# EasyEDA schematic Schematic_6502.json
TITLE: 6502 Computer schematics; REV: 1.0; Date: 2023-03-18; Sheet: 1/1; Drawn By: Alexandre Dumont; Company: -
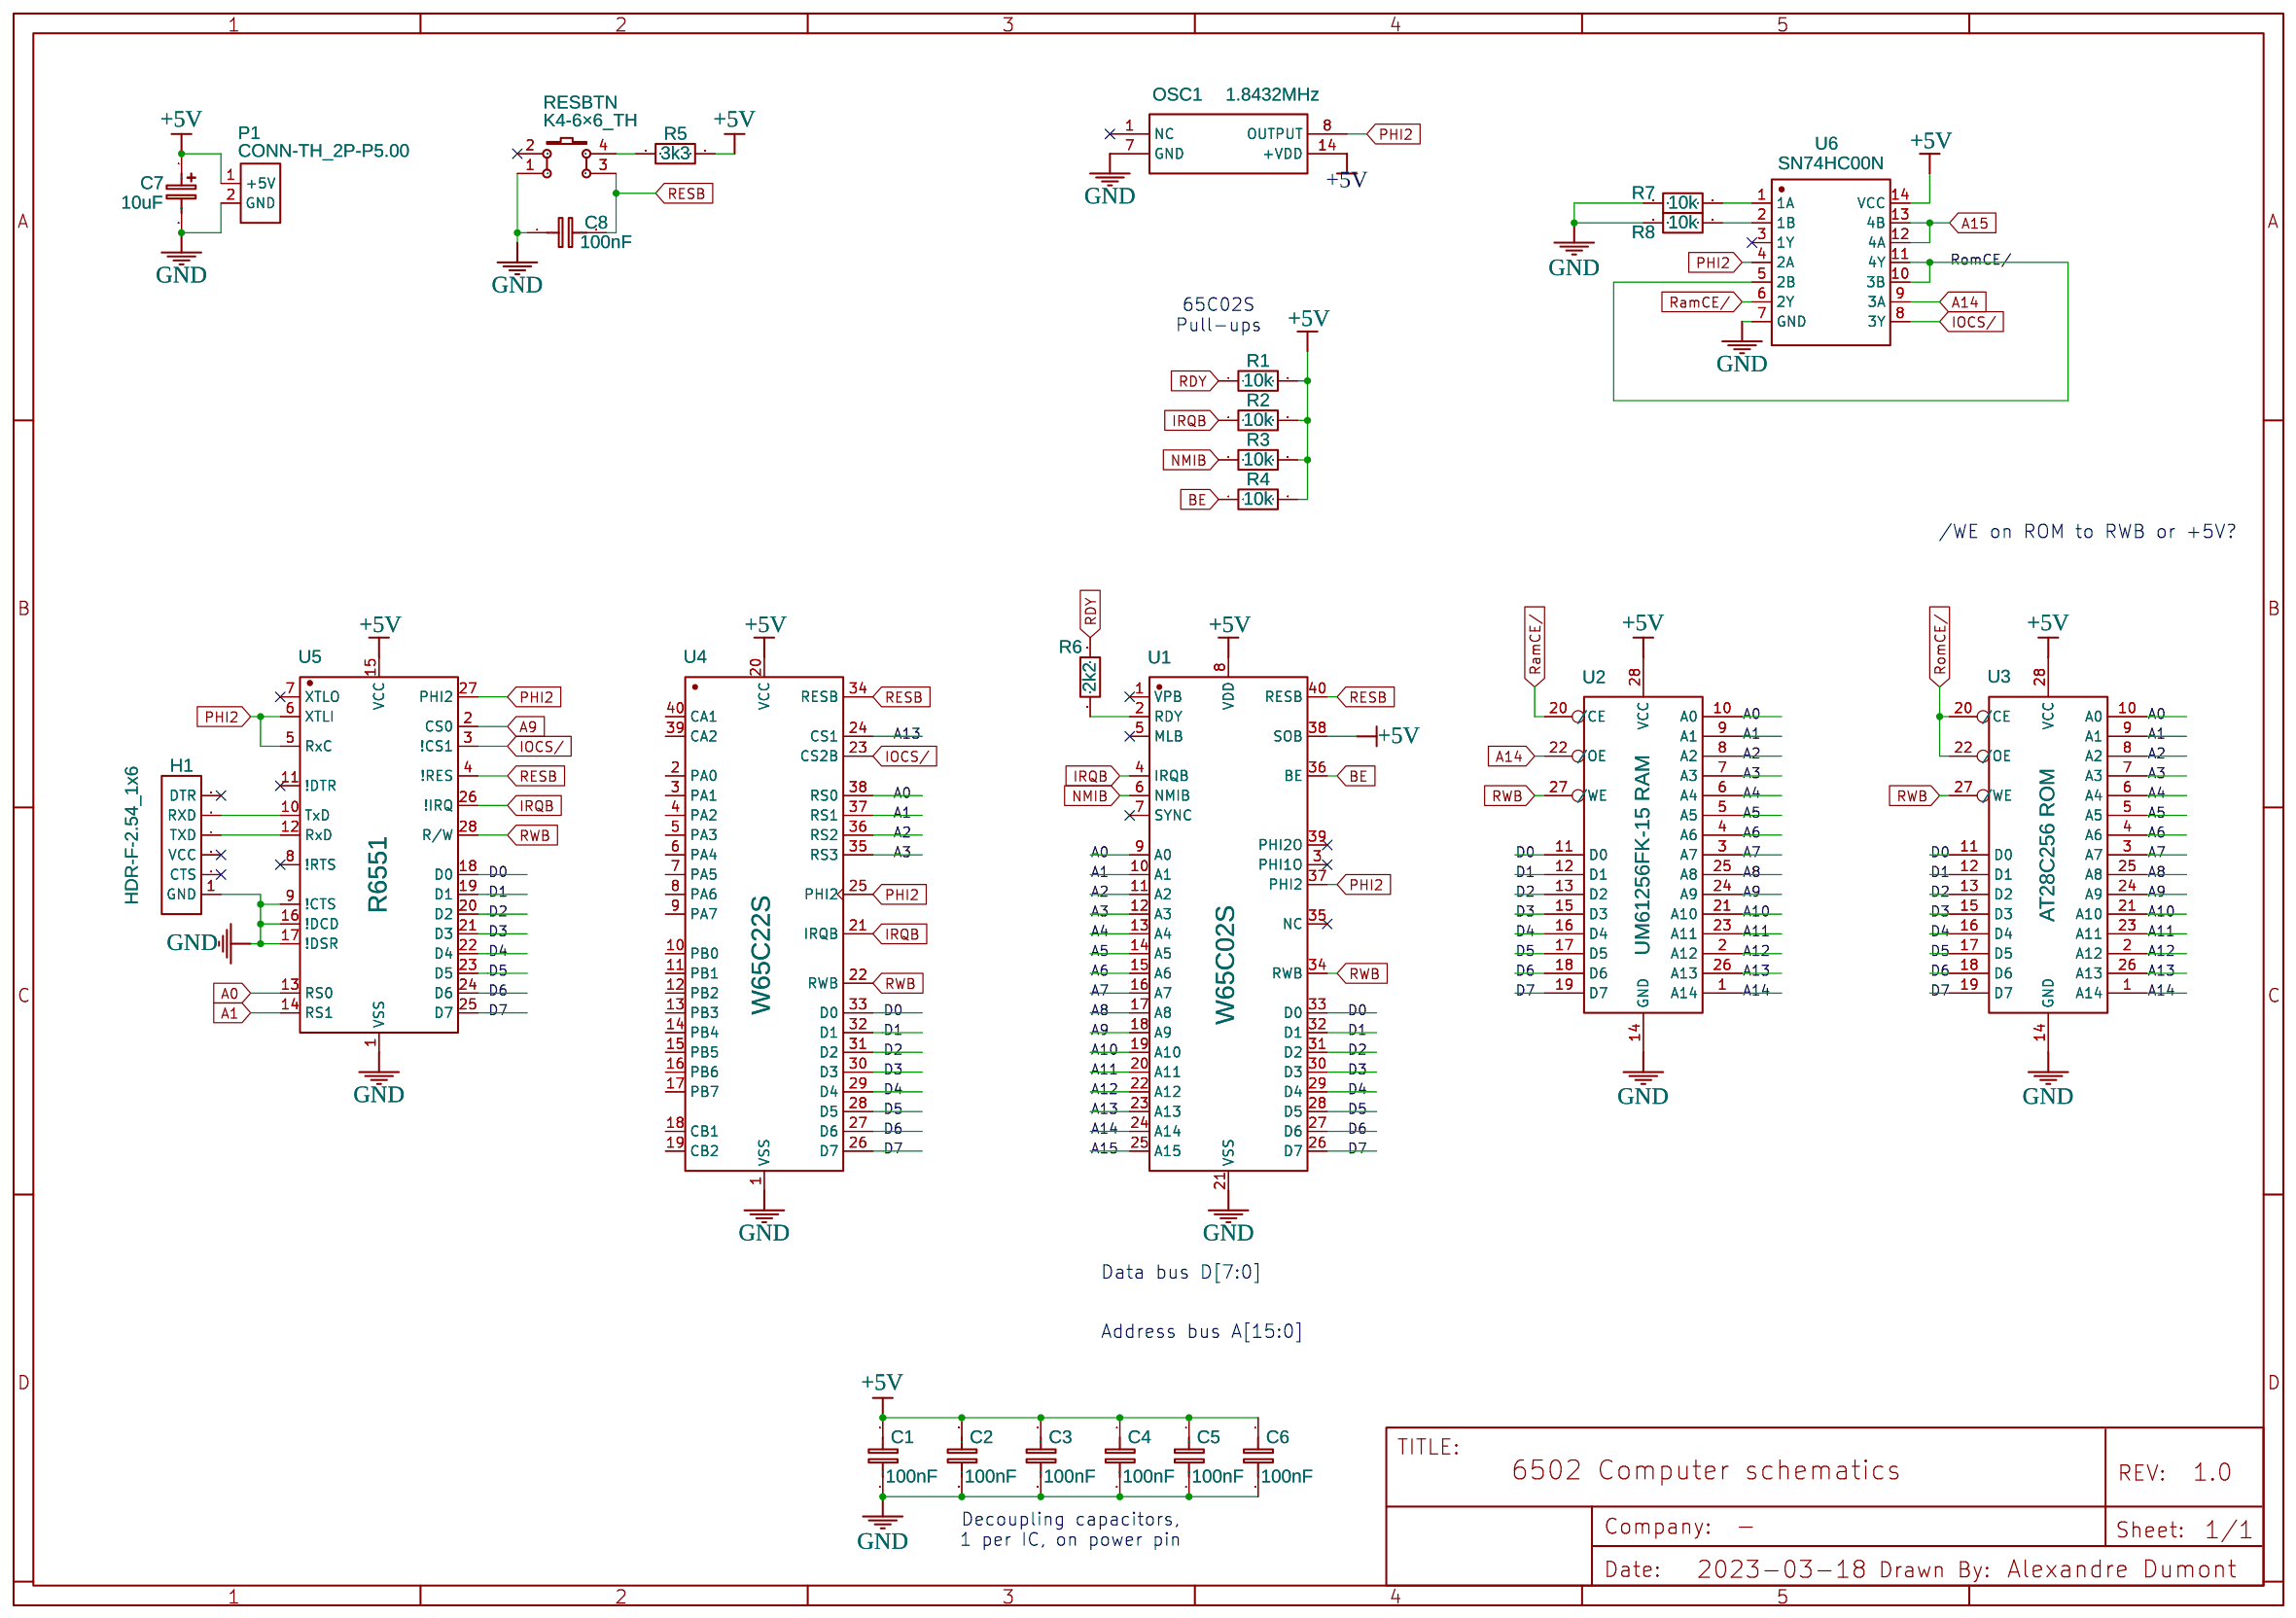
[diagram p0: schematic sheet]

## Parts
C1  100nF  [RAD-0.2]
C2  100nF  [RAD-0.2]
C3  100nF  [RAD-0.2]
C4  100nF  [RAD-0.2]
C5  100nF  [RAD-0.2]
C6  100nF  [RAD-0.2]
C7  10uF  [CAP-D5.0×F2.0]
C8  100nF  [RAD-0.2]
H1  HDR-F-2.54_1x6  [HDR-F-2.54_1X6]
OSC1  1.8432MHz  [QX14T50B1.843200B50TT]
P1  CONN-TH_2P-P5.00  [CONN-TH_2P-P5.00]
R1  10k  [R_AXIAL-0.5]
R2  10k  [R_AXIAL-0.5]
R3  10k  [R_AXIAL-0.5]
R4  10k  [R_AXIAL-0.5]
R5  3k3  [R_AXIAL-0.5]
R6  2k2  [R_AXIAL-0.5]
R7  10k  [R_AXIAL-0.5]
R8  10k  [R_AXIAL-0.5]
RESBTN  K4-6×6_TH  [KEY-TH_4P-L6.0-W6.0-P4.50-LS6.5]
U1  W65C02S  [DIP-40_L52.3-W13.9-P2.54-LS15.2-BL]
U2  UM61256FK-15 RAM  [DIP-28-300MIL-DZ]
U3  AT28C256 ROM  [DIP-28_L36.8-W15.5-P2.54-LS16.5-BL_AT28C256]
U4  W65C22S  [DIP-40_L52.3-W13.9-P2.54-LS15.2-BL]
U5  R6551  [DIP28-600]
U6  SN74HC00N  [DIP-14_L20.0-W7.6-P2.54-LS7.6-BL]

## Library data of the parts
C1-C6 C8 = C_RAD-0.2_EU: Contributor: LCEDA_Lib
C7 = CE_TH_D5.0×F2.0_EU: Contributor: LCEDA_Lib
H1 = HDR-F-2.54_1x6: Supplier Part: C40877; Supplier: LCSC; Contributor: LCEDA_Lib
OSC1 = QX14T50B1.843200B50TT: Contributor: milesaero
P1 = CONN-TH_2P-P5.00: Supplier: LCSC; Contributor: LCEDA_Lib
R1-R8 = R_AXIAL-0.5_EU: Contributor: LCEDA_Lib
RESBTN = K4-6×6_TH: Supplier: LCSC; Supplier Part: C136684; Manufacturer: 韩国韩荣; Manufacturer Part: K2-1102DP-E4SW-04; Contributor: LCEDA_Lib
U1 = W65C02S6TPG-14 BUS GROUPED: Manufacturer: Western Design Center (WDC); Manufacturer Part: W65C02S6TPG-14; Supplier: Mouser; Supplier Part: 955-W65C02S6TPG-14; link: https://www.mouser.es/datasheet/2/436/w65c02s-2572.pdf; Contributor: adumont
U2 U3 = AT28C256: Contributor: Alexandre Dumont
U4 = W65C22S6TPG-14 BUS GROUPED: Manufacturer: Western Design Center (WDC); Manufacturer Part: W65C22S6TPG-14; Supplier: Mouser; Supplier Part: 955-W65C22S6TPG-14; link: https://www.mouser.es/datasheet/2/436/w65c22-1197.pdf; Contributor: adumont
U5 = R6551: Contributor: Alexandre Dumont
U6 = SN74HC00N: Supplier: LCSC; Manufacturer: TI(德州仪器); Supplier Part: C2902; JLCPCB Part Class: Extended Part

## Nets
+5V: C1.1 C2.1 C3.1 C4.1 C5.1 C6.1 C7.1 OSC1.14(+VDD) P1.1(+5V) R1.2 R2.2 R3.2 R4.2 R5.2 U1.8(VDD) U1.38(SOB) U2.28(VCC) U3.28(VCC) U4.20(VCC) U5.15(VCC) U6.14(VCC)
GND: C1.2 C2.2 C3.2 C4.2 C5.2 C6.2 C7.2 C8.1 H1.1(GND) OSC1.7(GND) P1.2(GND) R7.1 R8.1 RESBTN.1 U1.21(VSS) U2.14(GND) U3.14(GND) U4.1(VSS) U5.1(VSS) U5.9(!CTS) U5.16(!DCD) U5.17(!DSR) U6.7(GND)
A0: U1.9(A0) U2.10(A0) U3.10(A0) U4.38(RS0) U5.13(RS0)
A1: U1.10(A1) U2.9(A1) U3.9(A1) U4.37(RS1) U5.14(RS1)
A2: U1.11(A2) U2.8(A2) U3.8(A2) U4.36(RS2)
A3: U1.12(A3) U2.7(A3) U3.7(A3) U4.35(RS3)
A4: U1.13(A4) U2.6(A4) U3.6(A4)
A5: U1.14(A5) U2.5(A5) U3.5(A5)
A6: U1.15(A6) U2.4(A6) U3.4(A6)
A7: U1.16(A7) U2.3(A7) U3.3(A7)
A8: U1.17(A8) U2.25(A8) U3.25(A8)
A9: U1.18(A9) U2.24(A9) U3.24(A9) U5.2(CS0)
A10: U1.19(A10) U2.21(A10) U3.21(A10)
A11: U1.20(A11) U2.23(A11) U3.23(A11)
A12: U1.22(A12) U2.2(A12) U3.2(A12)
A13: U1.23(A13) U2.26(A13) U3.26(A13) U4.24(CS1)
A14: U1.24(A14) U2.1(A14) U2.22(/OE) U3.1(A14) U6.9(3A)
A15: U1.25(A15) U6.12(4A) U6.13(4B)
BE: R4.1 U1.36(BE)
D0: U1.33(D0) U2.11(D0) U3.11(D0) U4.33(D0) U5.18(D0)
D1: U1.32(D1) U2.12(D1) U3.12(D1) U4.32(D1) U5.19(D1)
D2: U1.31(D2) U2.13(D2) U3.13(D2) U4.31(D2) U5.20(D2)
D3: U1.30(D3) U2.15(D3) U3.15(D3) U4.30(D3) U5.21(D3)
D4: U1.29(D4) U2.16(D4) U3.16(D4) U4.29(D4) U5.22(D4)
D5: U1.28(D5) U2.17(D5) U3.17(D5) U4.28(D5) U5.23(D5)
D6: U1.27(D6) U2.18(D6) U3.18(D6) U4.27(D6) U5.24(D6)
D7: U1.26(D7) U2.19(D7) U3.19(D7) U4.26(D7) U5.25(D7)
IOCS/: U4.23(CS2B) U5.3(!CS1) U6.8(3Y)
IRQB: R2.1 U1.4(IRQB) U4.21(IRQB) U5.26(!IRQ)
NMIB: R3.1 U1.6(NMIB)
PHI2: OSC1.8(OUTPUT) U1.37(PHI2) U4.25(PHI2) U5.5(RxC) U5.6(XTLI) U5.27(PHI2) U6.4(2A)
RamCE/: U2.20(/CE) U6.6(2Y)
RDY: R1.1 R6.1
RESB: C8.2 RESBTN.3 U1.40(RESB) U4.34(RESB) U5.4(!RES)
RomCE/: U3.20(/CE) U3.22(/OE) U6.5(2B) U6.10(3B) U6.11(4Y)
RWB: U1.34(RWB) U2.27(/WE) U3.27(/WE) U4.22(RWB) U5.28(R/W)
Net-(H1-4): H1.4(TXD) U5.12(RxD)
Net-(H1-5): H1.5(RXD) U5.10(TxD)
Net-(R5-1): R5.1 RESBTN.4
Net-(R6-2): R6.2 U1.2(RDY)
Net-(R7-2): R7.2 U6.1(1A)
Net-(R8-2): R8.2 U6.2(1B)

Not connected (* = marked no-connect by the designer): H1 2(CTS)* 3(VCC)* 6(DTR)*; OSC1 1(NC)*; RESBTN 2*; U1 1(VPB)* 3(PHI1O)* 5(MLB)* 7(SYNC)* 35(NC)* 39(PHI2O)*; U4 2(PA0) 3(PA1) 4(PA2) 5(PA3) 6(PA4) 7(PA5) 8(PA6) 9(PA7) 10(PB0) 11(PB1) 12(PB2) 13(PB3) 14(PB4) 15(PB5) 16(PB6) 17(PB7) 18(CB1) 19(CB2) 39(CA2) 40(CA1); U5 7(XTLO)* 8(!RTS)* 11(!DTR)*; U6 3(1Y)*

## Notes on the sheet
- 65C02S
  Pull-ups
- /WE on ROM to RWB or +5V?
- Data bus D[7:0]
- Address bus A[15:0]
- Decoupling capacitors,
  1 per IC, on power pin
